# Altium schematic sheet Starboard.SchDoc: Starboard
size Letter; Author: Nicholas J. Sorensen, and Erik F. Halliwell; DocumentNumber: 1; SheetNumber: 1; SheetTotal: 8; CopyrightYear: 2019
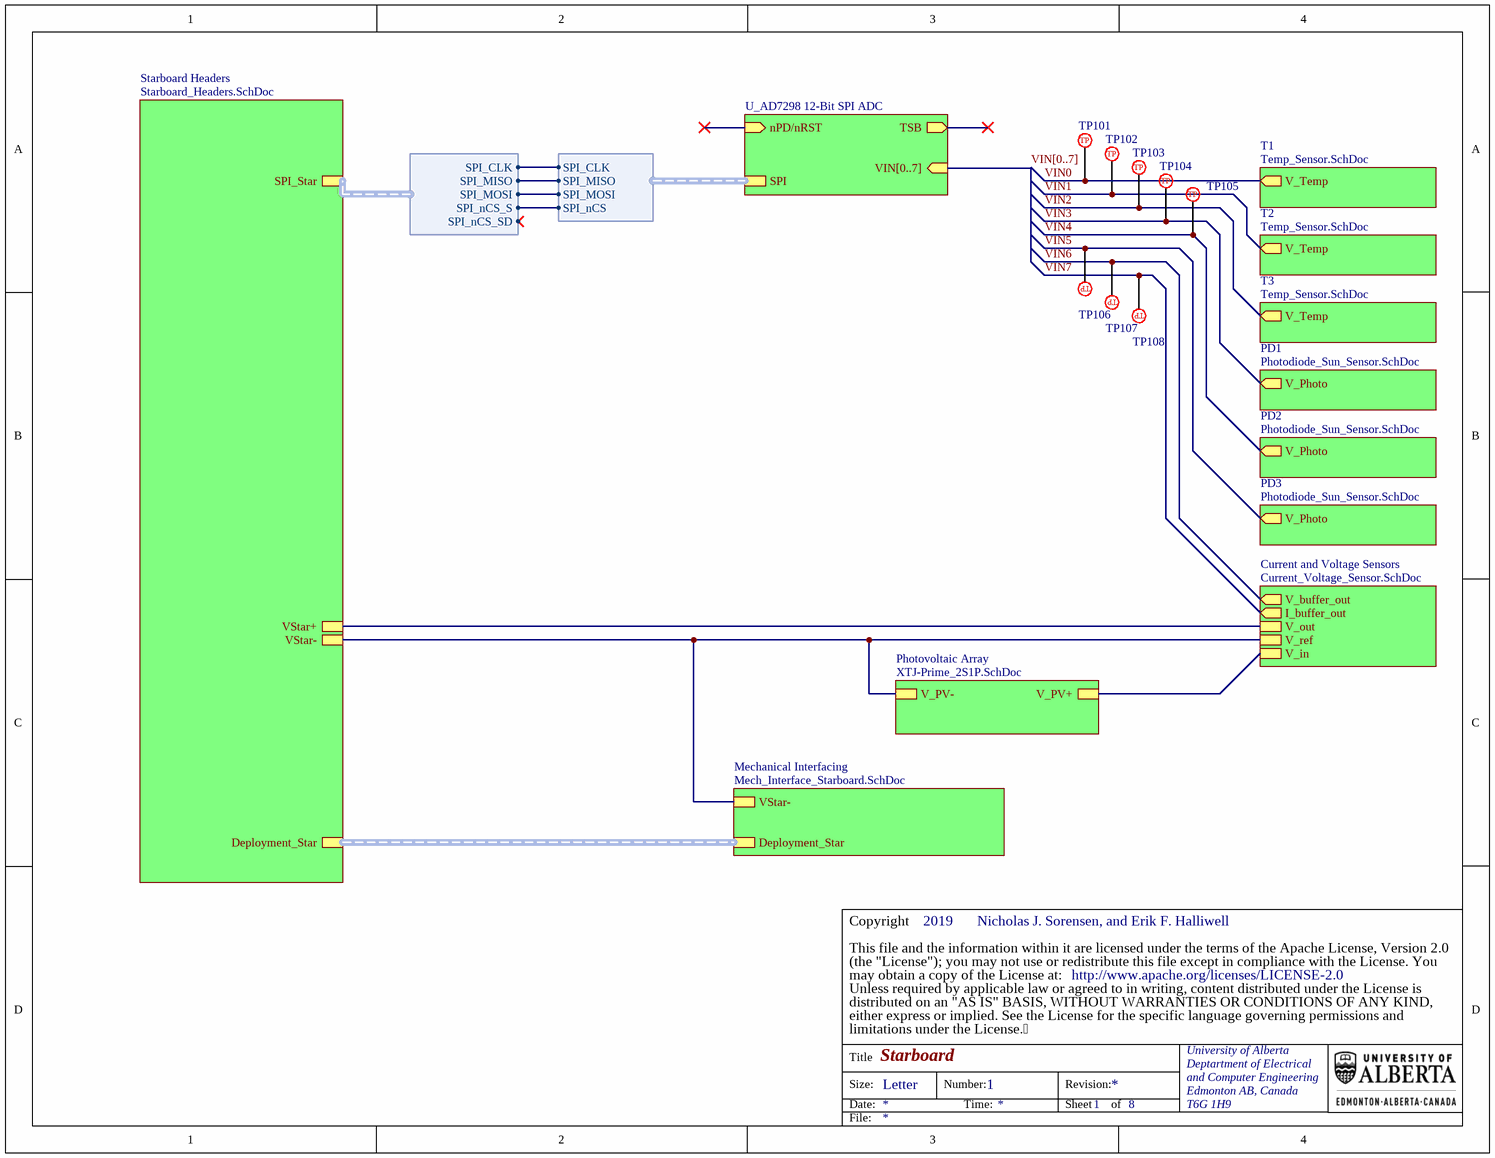
[diagram p0: Starboard.SchDoc]

## Parts
TP101  5017  [KS-5017]  (value not drawn)
TP102  5017  [KS-5017]  (value not drawn)
TP103  5017  [KS-5017]  (value not drawn)
TP104  5017  [KS-5017]  (value not drawn)
TP105  5017  [KS-5017]  (value not drawn)
TP106  5017  [KS-5017]  (value not drawn)
TP107  5017  [KS-5017]  (value not drawn)
TP108  5017  [KS-5017]  (value not drawn)

## Sub-sheets
Current and Voltage Sensors = Current_Voltage_Sensor.SchDoc: V_out, V_ref, V_in, I_buffer_out (out), V_buffer_out (out)
Mechanical Interfacing = Mech_Interface_Starboard.SchDoc: VStar-, Deployment_Star (harness Deployment_Star)
PD1 = Photodiode_Sun_Sensor.SchDoc: V_Photo (out)
PD2 = Photodiode_Sun_Sensor.SchDoc: V_Photo (out)
PD3 = Photodiode_Sun_Sensor.SchDoc: V_Photo (out)
Photovoltaic Array = XTJ-Prime_2S1P.SchDoc: V_PV+, V_PV-
Starboard Headers = Starboard_Headers.SchDoc: SPI_Star (harness SPI_Star), VStar+, Deployment_Star (harness Deployment_Star), VStar-
T1 = Temp_Sensor.SchDoc: V_Temp (out)
T2 = Temp_Sensor.SchDoc: V_Temp (out)
T3 = Temp_Sensor.SchDoc: V_Temp (out)
U_AD7298 12-Bit SPI ADC = AD7298 12-Bit SPI ADC.SchDoc: nPD/nRST (in), TSB (out), VIN[0..7] (in), SPI (harness AD7298_SPI)

## Harnesses
AD7298_SPI: SPI_CLK, SPI_MISO, SPI_MOSI, SPI_nCS
SPI_Star: SPI_CLK, SPI_MISO, SPI_MOSI, SPI_nCS_S, SPI_nCS_SD

## Nets
VIN0: TP101.1 ; sheet T1/V_Temp
VIN1: TP102.1 ; sheet T2/V_Temp
VIN2: TP103.1 ; sheet T3/V_Temp
VIN3: TP104.1 ; sheet PD1/V_Photo
VIN4: TP105.1 ; sheet PD2/V_Photo
VIN5: TP106.1 ; sheet PD3/V_Photo
VIN6: TP107.1 ; sheet Current and Voltage Sensors/V_buffer_out
VIN7: TP108.1 ; sheet Current and Voltage Sensors/I_buffer_out
(unnamed): sheet Photovoltaic Array/V_PV+, sheet Current and Voltage Sensors/V_in
(unnamed): sheet Photovoltaic Array/V_PV-, sheet Current and Voltage Sensors/V_ref, sheet Mechanical Interfacing/VStar-, sheet Starboard Headers/VStar-
(unnamed): sheet Current and Voltage Sensors/V_out, sheet Starboard Headers/VStar+
(unnamed): sheet U_AD7298 12-Bit SPI ADC/SPI.SPI_CLK, sheet Starboard Headers/SPI_Star.SPI_CLK
(unnamed): sheet U_AD7298 12-Bit SPI ADC/SPI.SPI_MISO, sheet Starboard Headers/SPI_Star.SPI_MISO
(unnamed): sheet U_AD7298 12-Bit SPI ADC/SPI.SPI_MOSI, sheet Starboard Headers/SPI_Star.SPI_MOSI
(unnamed): sheet U_AD7298 12-Bit SPI ADC/SPI.SPI_nCS, sheet Starboard Headers/SPI_Star.SPI_nCS_S

## Buses and harness runs
bus VIN[0..7] = sheet U_AD7298 12-Bit SPI ADC/VIN[0..7]
harness sheet Mechanical Interfacing/Deployment_Star = sheet Starboard Headers/Deployment_Star

## Notes on the sheet
- (the "License"); you may not use or redistribute this file except in compliance with the License. You
- This file and the information within it are licensed under the terms of the Apache License, Version 2.0
- Copyright
- Unless required by applicable law or agreed to in writing, content distributed under the License is
- distributed on an "AS IS" BASIS, WITHOUT WARRANTIES OR CONDITIONS OF ANY KIND,
- either express or implied. See the License for the specific language governing permissions and
- limitations under the License.
- may obtain a copy of the License at:
- http://www.apache.org/licenses/LICENSE-2.0
- Title
- Size:
- Date:
- Letter
- Number:
- Time:
- Revision:
- Sheet
- of
- University of Alberta
- Deptartment of Electrical
- and Computer Engineering
- Edmonton AB, Canada
- T6G 1H9
- File:
- (in symbol PTP-KS-00001) TP

## Library data of the parts
TP101-TP108 = PTP-KS-00001: PC TEST POINT MINI SMD; Index: 1; Supplier 1: Digi-key; Supplier 2: Newark; Supplier 3: Mouser; Part Number: PTP-KS-00001; Manufacturer Part Number: 5017; Supplier Part Number 1: 36-5017CT-ND; Publisher: AlbertaSat; Published: 3/15/2016; LatestRevisionDate: 3/15/2016; LatestRevisionNote: ...; PackageReference: KS-5017; PackageDescription: Testpoint Lug Mini SMD 27X10X152; Supplier Link: http://www.digikey.ca/product-detail/en/keystone-electronics/5017/36-5017TR-ND/2217304